# Altium schematic sheet Audio.SchDoc
size A4; Revision: B.1(PCB.SCH)
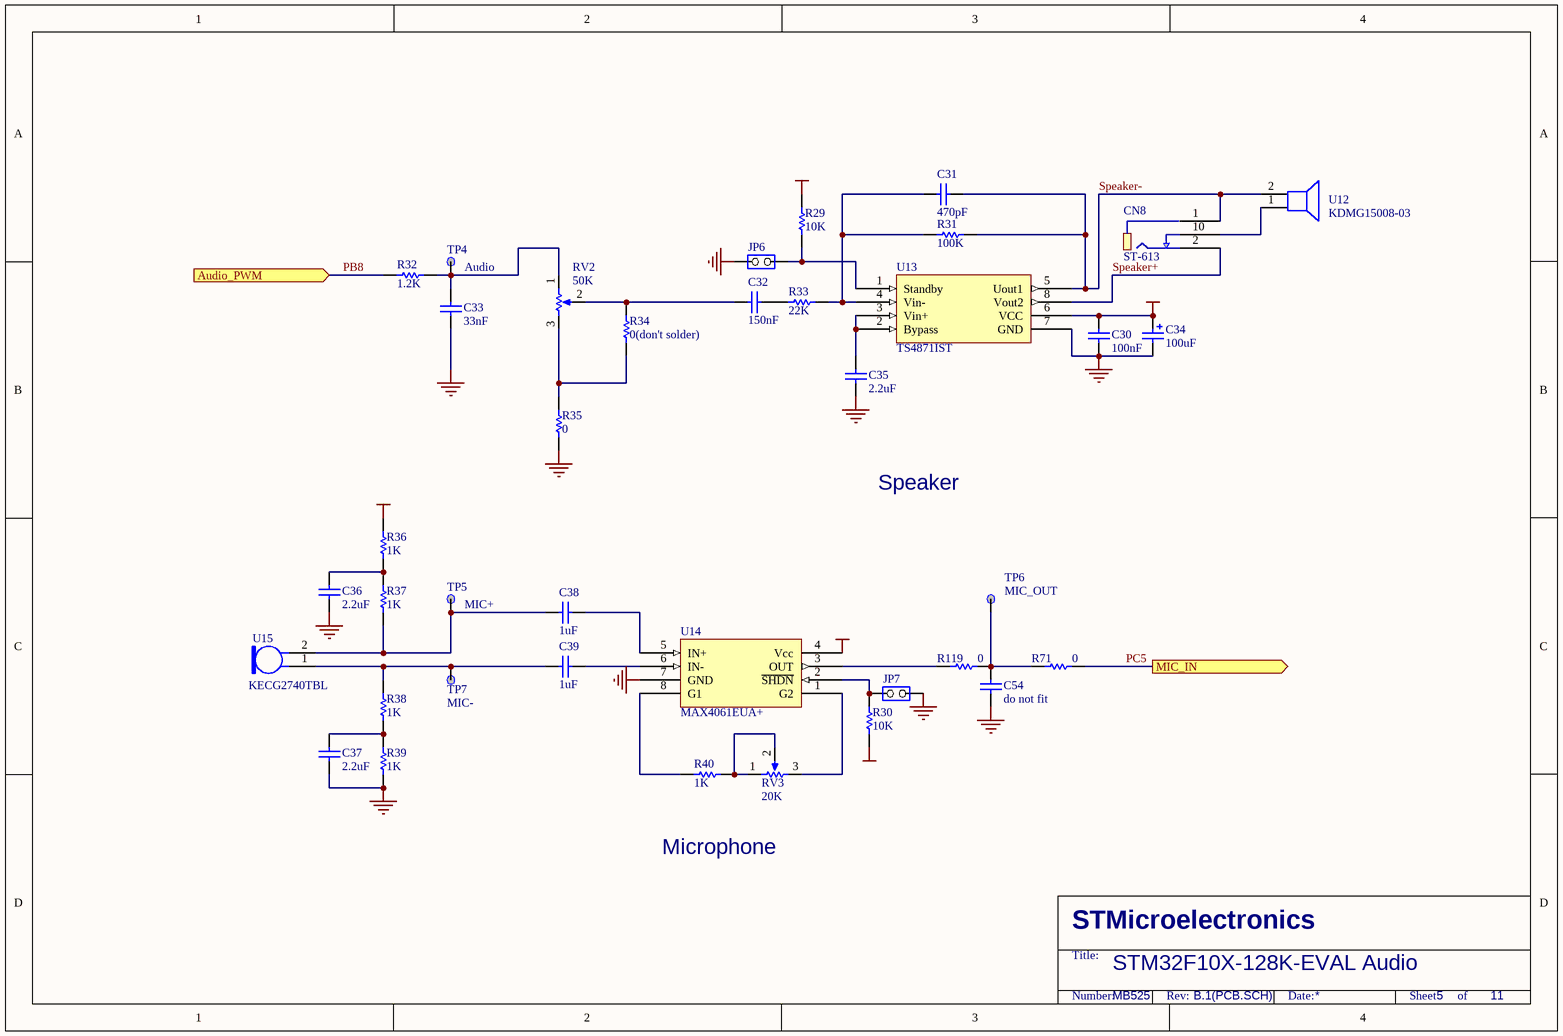
[diagram p0: Audio.SchDoc]

## Parts
C30  100nF  [0603P]
C31  470pF  [0603]
C32  150nF  [0603]
C33  33nF  [0603]
C34  100uF  [TAN-B]
C35  2.2uF  [0805]
C36  2.2uF  [0805]
C37  2.2uF  [0805]
C38  1uF  [0603]
C39  1uF  [0603]
C54  do not fit  [0603]
CN8  ST-613  [PJST-613]
JP6  (no value)  [SIP2]
JP7  (no value)  [SIP2]
R29  10K  [0603]
R30  10K  [0603]
R31  100K  [0603]
R32  1.2K  [0603]
R33  22K  [0603]
R34  0(don't solder)  [0603]
R35  0  [0603]
R36  1K  [0603]
R37  1K  [0603]
R38  1K  [0603]
R39  1K  [0603]
R40  1K  [0603]
R71  0  [0805]
R119  0  [0603]
RV2  50K  [3314-J]
RV3  20K  [3314-J]
TP4  Audio  [TP]
TP5  MIC+  [TP]
TP6  MIC_OUT  [TP]
TP7  MIC-  [TP]
U12  KDMG15008-03  [KS1508]
U13  TS4871IST  [TSSOP8]
U14  MAX4061EUA+  [tssop8]
U15  KECG2740TBL  [KEC2740]

## Ports
Audio_PWM (in), MIC_IN (out)

## Nets
+3V3: C30.2 C34.1 R29.2 R30.1 R36.2 U13.6(VCC) U14.4(Vcc)
GND: C30.1 C33.1 C34.2 C35.2 C36.2 C37.2 C54.2 JP6.2(NO) JP7.2(NO) R35.1 R39.1 U13.7(GND) U14.7(GND)
PB8: R32.1 ; port Audio_PWM
PC5: R71.1 ; port MIC_IN
Speaker+: CN8.2 U13.8(Vout2)
Speaker-: C31.2 CN8.1 R31.2 U12.2(--) U13.5(Uout1)
NetC31_1: C31.1 R31.1 R33.2 U13.4(Vin-)
NetC32_1: C32.1 R34.2 RV2.2(TAP)
NetC32_2: C32.2 R33.1
NetC33_2: C33.2 R32.2 RV2.1(BOT) TP4.1
NetC35_1: C35.1 U13.2(Bypass) U13.3(Vin+)
NetC36_1: C36.1 R36.1 R37.1
NetC37_1: C37.1 R38.1 R39.2
NetC38_1: C38.1 R37.2 TP5.1 U15.2
NetC38_2: C38.2 U14.5(IN+)
NetC39_1: C39.1 R38.2 TP7.1 U15.1
NetC39_2: C39.2 U14.6(IN-)
NetC54_1: C54.1 R71.2 R119.1 TP6.1
NetCN8_10: CN8.10 U12.1(+)
NetJP6_1: JP6.1(COMMON) R29.1 U13.1(Standby)
NetJP7_1: JP7.1(COMMON) R30.2 U14.2(~{SHDN})
NetR34_1: R34.1 R35.2 RV2.3(TOP)
NetR40_1: R40.1 RV3.1(BOT) RV3.2(TAP)
NetR40_2: R40.2 U14.8(G1)
NetR119_2: R119.2 U14.3(OUT)
NetRV3_3: RV3.3(TOP) U14.1(G2)

## Notes on the sheet
- Speaker
- Microphone
- STM32F10X-128K-EVAL Audio
- MB525
- 5
- 11
- STMicroelectronics
- Title:
- Number:
- Rev:
- Date:
- Sheet       of

## Library data of the parts
C30-C33 C35-C39 = CAP: Capacitor; Value: 100pF; Published: 8-Jun-2000; Revision: July-2002: Re-released for DXP Platform.; Publisher: Altium Limited
C34 = Cap Pol1: Polarized Capacitor (Radial); Value: 100pF; Published: 8-Jun-2000; Revision: July-2002: Re-released for DXP Platform.; Publisher: Altium Limited
C54 = CAP: Capacitor; Value: 100nF; Published: 8-Jun-2000; Revision: July-2002: Re-released for DXP Platform.; Publisher: Altium Limited
JP6 JP7 = JP2
R29-R35 R71 R119 = Res1: Resistor; Value: 1K; Published: 8-Jun-2000; Revision: July-2002: Re-released for DXP Platform.; Publisher: Altium Limited
R36-R40 = Res1: Resistor; Published: 8-Jun-2000; Revision: July-2002: Re-released for DXP Platform.; Publisher: Altium Limited; Value: 1K
RV2 RV3 = RV
TP4-TP7 = TP
U12 = Speaker: Loudspeaker; Published: 24-Mar-1999; Revision: July-2002: Re-released for DXP Platform.; Publisher: Altium Limited
U15 = Mic2: Microphone; Published: 24-Mar-1999; Revision: July-2002: Re-released for DXP Platform.; Publisher: Altium Limited